# Altium schematic sheet open-weller-pen.SchDoc: Add schematic title here
size A3; CheckedBy: tbd; CompanyName: OST; Organization: OST Ostschweizer Fachhochschule; Address1: Werdenbergstrasse 4; Address2: 9471 Buchs; Address3: Switzerland; SheetNumber: 1; SheetTotal: 1; Size: A3; ShortDescription: Add schematic description here
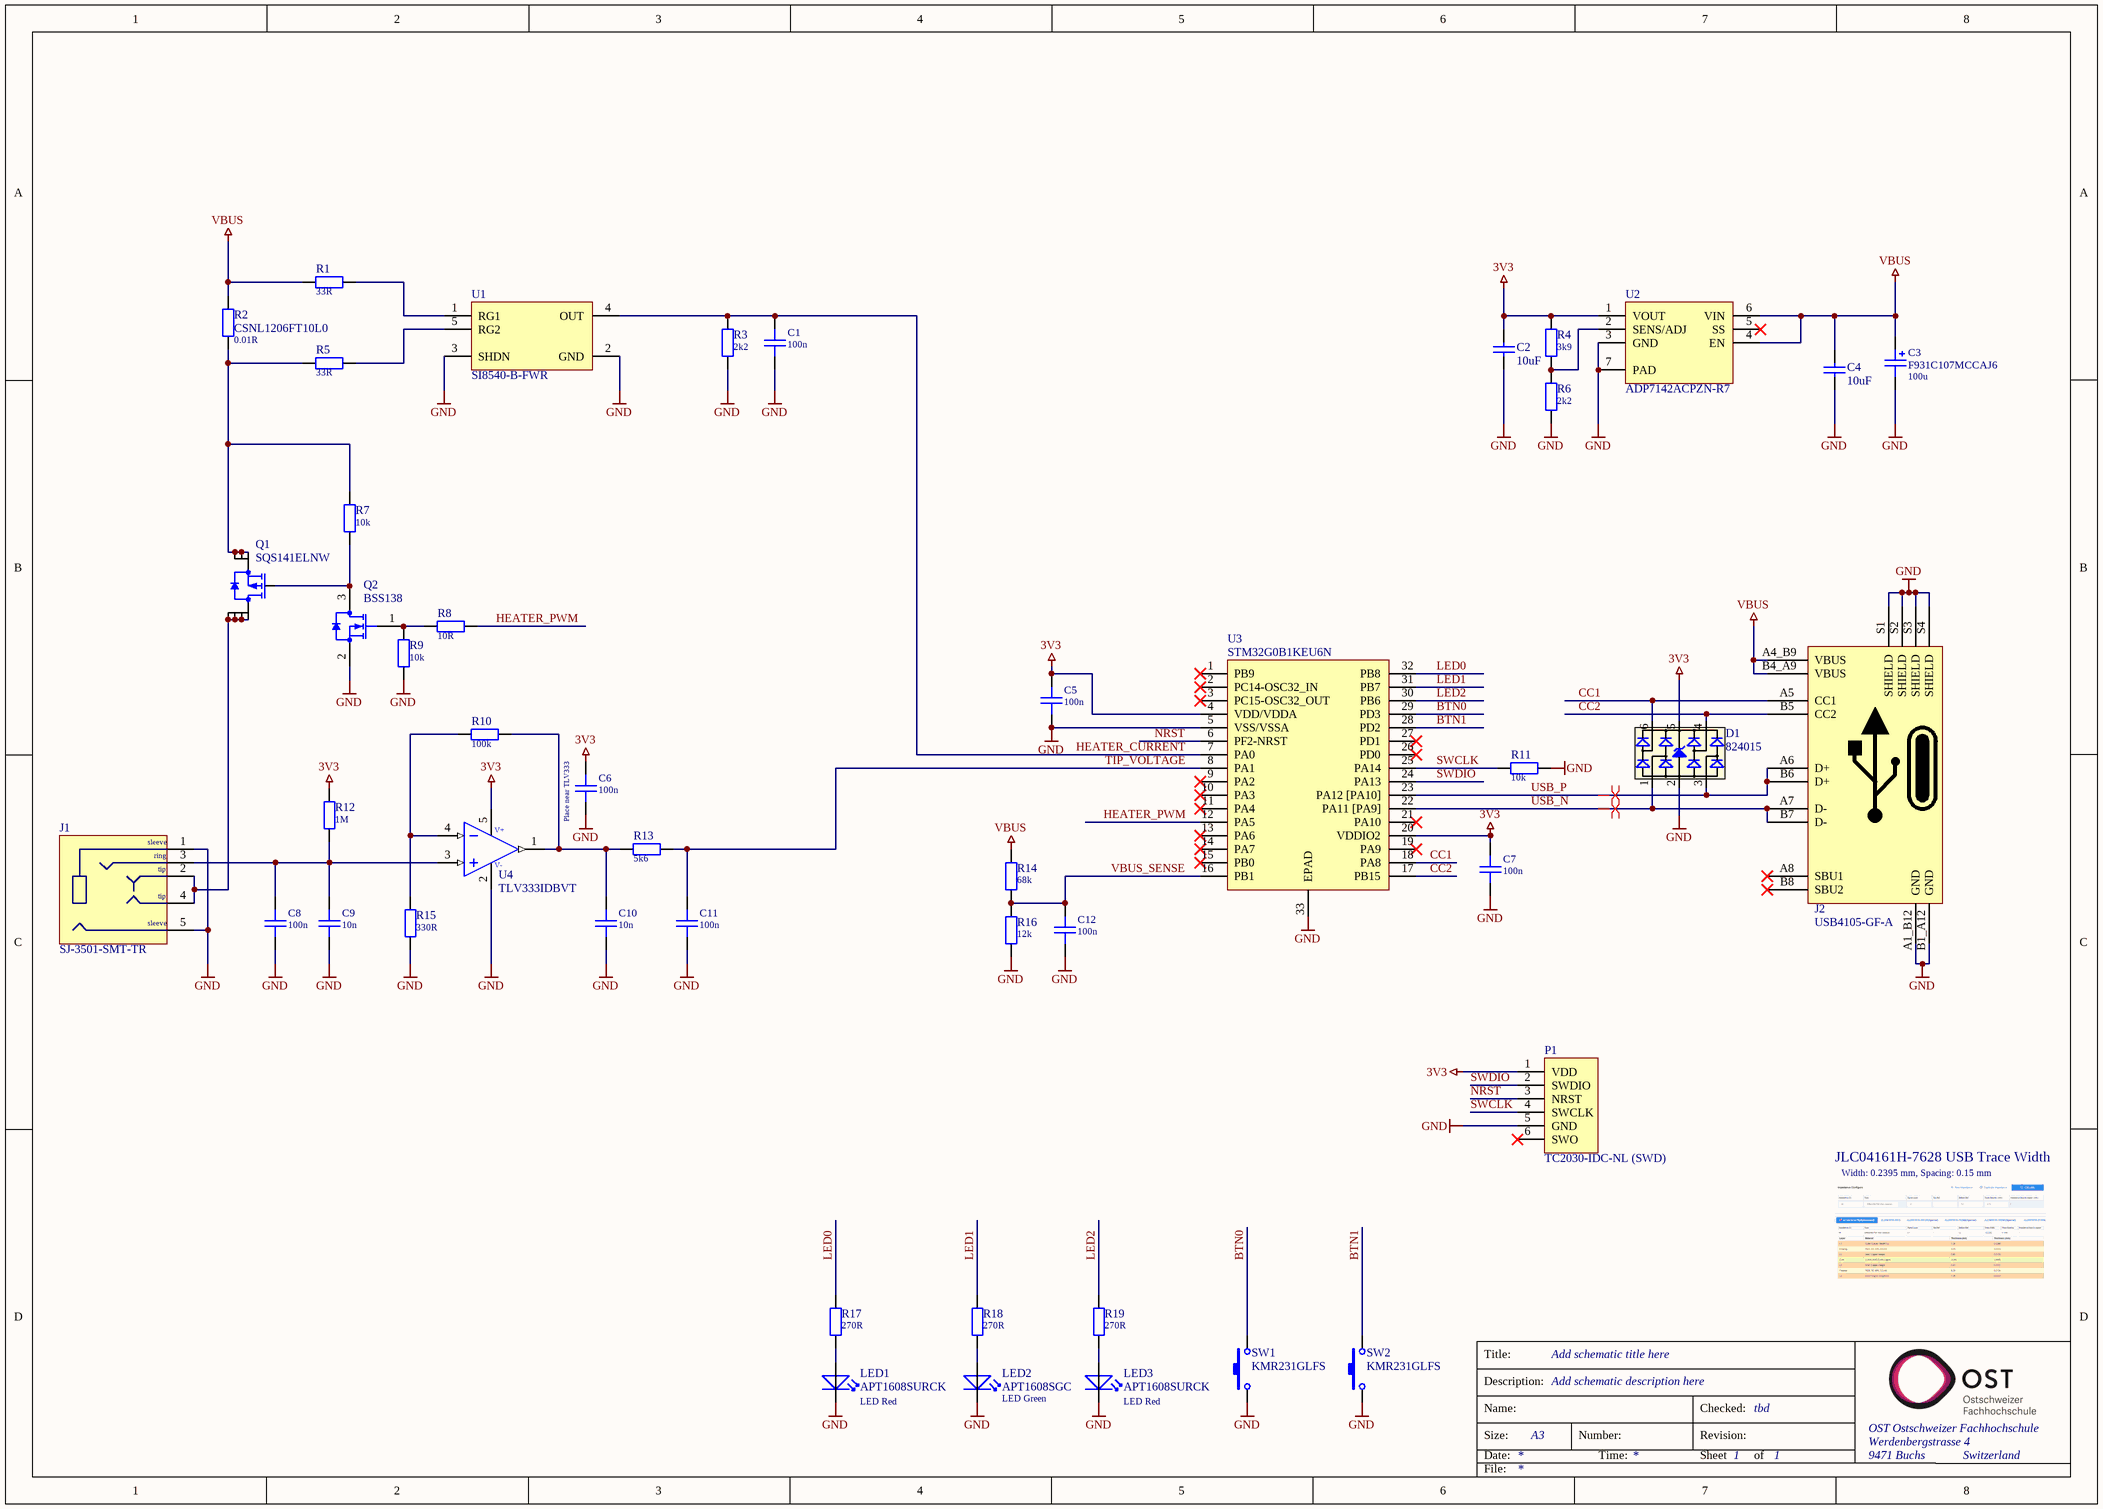
[diagram p0: open-weller-pen.SchDoc]

## Parts
C1  value 100n  [Generic_Cap0603_2_R]  (hidden comment: 06035C104kAT2A)
C2  ShortDescription: 10uF  [Generic_Cap0603_2_RW]  (hidden comment: GRM188R61E106KA73D)
C3  F931C107MCCAJ6  value 100u  [Generic_CPOL_C-2312_1P_2N_2]
C4  ShortDescription: 10uF  [Generic_Cap0603_2_RW]  (hidden comment: GRM188R61E106KA73D)
C5  value 100n  [Generic_Cap0603_2_R]  (hidden comment: 06035C104kAT2A)
C6  value 100n  [Generic_Cap0603_2_R]  (hidden comment: 06035C104kAT2A)
C7  value 100n  [Generic_Cap0603_2_R]  (hidden comment: 06035C104kAT2A)
C8  value 100n  [Generic_Cap0603_2_R]  (hidden comment: 06035C104kAT2A)
C9  value 10n  [Generic_Cap0603_2_R]  (hidden comment: 06035C103kAT2A)
C10  value 10n  [Generic_Cap0603_2_R]  (hidden comment: 06035C103kAT2A)
C11  value 100n  [Generic_Cap0603_2_R]  (hidden comment: 06035C104kAT2A)
C12  value 100n  [Generic_Cap0603_2_R]  (hidden comment: 06035C104kAT2A)
D1  824015  [GENERIC_SOT23-6_6_R]
J1  SJ-3501-SMT-TR  [CUI_SJ-3501-SMT-TR_5]
J2  USB4105-GF-A  [GCT_USB4105-GF-A_16_R]
LED1  APT1608SURCK  [Kingbright_1608_2_RW]
LED2  APT1608SGC  [Kingbright_1608_2_RW]
LED3  APT1608SURCK  [Kingbright_1608_2_RW]
P1  TC2030-IDC-NL (SWD)  [TagConnectLLC_TC2030_6]  (no BOM)
Q1  SQS141ELNW  [Vishay_PowerPAK_1212-8_8]
Q2  BSS138  [Generic_SOT23_3_RWH]
R1  value 33R  [Generic_Res0603_2_RW]  (hidden comment: RC0603FR-0733RL)
R2  CSNL1206FT10L0  value 0.01R  [Generic_Res1206_2_RW]
R3  value 2k2  [Generic_Res0603_2_RW]  (hidden comment: RC0603FR-072K2L)
R4  value 3k9  [Generic_Res0603_2_RW]  (hidden comment: RC0603FR-073K9L)
R5  value 33R  [Generic_Res0603_2_RW]  (hidden comment: RC0603FR-0733RL)
R6  value 2k2  [Generic_Res0603_2_RW]  (hidden comment: RC0603FR-072K2L)
R7  value 10k  [Generic_Res0603_2_RW]  (hidden comment: RC0603FR-0710KL)
R8  value 10R  [Generic_Res0603_2_RW]  (hidden comment: RC0603FR-0710RL)
R9  value 10k  [Generic_Res0603_2_RW]  (hidden comment: RC0603FR-0710KL)
R10  value 100k  [Generic_Res0603_2_RW]  (hidden comment: RC0603FR-07100KL)
R11  value 10k  [Generic_Res0603_2_RW]  (hidden comment: RC0603FR-0710KL)
R12  value 1M  [Generic_Res0603_2_RW]  (hidden comment: RC0603FR-071ML)
R13  value 5k6  [Generic_Res0603_2_RW]  (hidden comment: RC0603FR-075K6L)
R14  value 68k  [Generic_Res0603_2_RW]  (hidden comment: RC0603FR-0768KL)
R15  value 330R  [Generic_Res0603_2_RW]  (hidden comment: RC0603FR-07330RL)
R16  value 12k  [Generic_Res0603_2_RW]  (hidden comment: RC0603FR-0712KL)
R17  value 270R  [Generic_Res0603_2_RW]  (hidden comment: RC0603FR-07270RL)
R18  value 270R  [Generic_Res0603_2_RW]  (hidden comment: RC0603FR-07270RL)
R19  value 270R  [Generic_Res0603_2_RW]  (hidden comment: RC0603FR-07270RL)
SW1  KMR231GLFS  [CK_KMR231GLFS_4]
SW2  KMR231GLFS  [CK_KMR231GLFS_4]
U1  SI8540-B-FWR  [GENERIC_SOT23-5_5_R]
U2  ADP7142ACPZN-R7  [ANALOG_LFCSP6_7_R]
U3  STM32G0B1KEU6N  [ST_UFQFPN32_33_R]
U4  TLV333IDBVT  [TI_SOT23_5_RH]

## Nets
3V3: C2.2 C5.2 C6.2 C7.2 D1.5(VDD) P1.1(VDD) R4.1 R12.1 U2.1(VOUT) U3.4(VDD/VDDA) U3.20(VDDIO2) U4.5(V+)
GND: C1.1 C2.1 C3.2 C4.1 C5.1 C6.1 C7.1 C8.1 C9.1 C10.1 C11.1 C12.1 D1.2(GND) J1.1(sleeve) J1.5(sleeve) J2.A1_B12(GND) J2.B1_A12(GND) J2.S1(SHIELD) J2.S2(SHIELD) J2.S3(SHIELD) J2.S4(SHIELD) LED1.1(K) LED2.1(K) LED3.1(K) P1.5(GND) Q2.2(S) R3.2 R6.2 R9.2 R11.2 R15.1 R16.2 SW1.1 SW2.1 U1.2(GND) U1.3(SHDN) U2.3(GND) U2.7(PAD) U3.5(VSS/VSSA) U3.33(EPAD) U4.2(V-)
VBUS: C3.1 C4.2 J2.A4_B9(VBUS) J2.B4_A9(VBUS) R1.2 R2.1 R14.1 U2.4(EN) U2.6(VIN)
BTN0: SW1.2 U3.29(PD3)
BTN1: SW2.2 U3.28(PD2)
CC1: D1.6(I/O4) J2.A5(CC1) U3.18(PA8)
CC2: D1.4(I/O3) J2.B5(CC2) U3.17(PB15)
HEATER_CURRENT: C1.2 R3.1 U1.4(OUT) U3.7(PA0)
HEATER_PWM: R8.1 U3.12(PA5)
LED0: R17.1 U3.32(PB8)
LED1: R18.1 U3.31(PB7)
LED2: R19.1 U3.30(PB6)
NRST: P1.3(NRST) U3.6(PF2-NRST)
SWCLK: P1.4(SWCLK) R11.1 U3.25(PA14)
SWDIO: P1.2(SWDIO) U3.24(PA13)
TIP_VOLTAGE: C11.2 R13.1 U3.8(PA1)
USB_N: D1.1(I/O1) J2.A7(D-) J2.B7(D-) U3.22(PA11_[PA9])
USB_P: D1.3(I/O2) J2.A6(D+) J2.B6(D+) U3.23(PA12_[PA10])
VBUS_SENSE: C12.2 R14.2 R16.1 U3.16(PB1)
NetC8_2: C8.2 C9.2 J1.3(ring) R12.2 U4.3(IN+)
NetC10_2: C10.2 R10.2 R13.2 U4.1(OUT)
NetJ1_2: J1.2(tip) J1.4(tip) Q1.5(D) Q1.6(D) Q1.7(D) Q1.8(D)
NetLED1_2: LED1.2(A) R17.2
NetLED2_2: LED2.2(A) R18.2
NetLED3_2: LED3.2(A) R19.2
NetQ1_1: Q1.1(S) Q1.2(S) Q1.3(S) R2.2 R5.2 R7.1
NetQ1_4: Q1.4(G) Q2.3(D) R7.2
NetQ2_1: Q2.1(G) R8.2 R9.1
NetR1_1: R1.1 U1.1(RG1)
NetR4_2: R4.2 R6.1 U2.2(SENS/ADJ)
NetR5_1: R5.1 U1.5(RG2)
NetR10_1: R10.1 R15.2 U4.4(IN-)

Not connected (* = marked no-connect by the designer): J2 A8(SBU1)* B8(SBU2)*; P1 6(SWO)*; U2 5(SS)*; U3 1(PB9)* 2(PC14-OSC32_IN)* 3(PC15-OSC32_OUT)* 9(PA2)* 10(PA3)* 11(PA4)* 13(PA6)* 14(PA7)* 15(PB0)* 19(PA9)* 21(PA10)* 26(PD0)* 27(PD1)*

## Layout directives
differential pair: USB_N, USB_P

## Notes on the sheet
- (near C6) Place near TLV333
- JLC04161H-7628 USB Trace Width
- Width: 0.2395 mm, Spacing: 0.15 mm
- Title:
- Description:
- Size:
- Date:
- Name:
- Number:
- Time:
- Revision:
- Sheet
- Checked:
- of
- File:

## Library data of the parts
C1 C5-C8 C11 C12 = KYOCERA_AVX_X7R-DIELECTRIC-0000-A.1: 100n, X7R, 10%, 50V, 0603; Manufacturer: Kyocera AVX; ShortDescription: 100n; Manufacturer PartNr: 06035C104kAT2A
C2 C4 = Baugruppenfertigung-0041-A.5: 10uF, X5R, 10%, 25V; Manufacturer: Murata; Manufacturer PartNr: GRM188R61E106KA73D
C3 = KRSA-0126-A.1: 100u, TANTAL, 20%, 16V, C(2312); Manufacturer: AVX; ShortDescription: 100u; Manufacturer PartNr: F931C107MCCAJ6
C9 C10 = KYOCERA_AVX_X7R-DIELECTRIC-0001-A.2: 10n, X7R, 10%, 50V, 0603; Manufacturer: Kyocera AVX; ShortDescription: 10n; Manufacturer PartNr: 06035C103kAT2A
D1 = KRSA-0098-A.1: TVS Diode Array, 5V, Unidirectional; Manufacturer: Wurth; ShortDescription: 824015; Manufacturer PartNr: 824015
J1 = KRSA-0117-A.1: Audio Jack, 3.5mm, Mid Mount; Manufacturer: CUI; Manufacturer PartNr: SJ-3501-SMT-TR; ShortDescription: SJ-3501-SMT-TR
J2 = KRSA-0082-A.1: USB Type C, Edge Mount, USB 2.0; Manufacturer: GCT; ShortDescription: USB-C; Manufacturer PartNr: USB4105-GF-A
LED1 LED3 = Baugruppenfertigung-0039-A.1: LED Red; Manufacturer: Kingbright; Manufacturer PartNr: APT1608SURCK; ShortDescription: LED Red
LED2 = Baugruppenfertigung-0038-A.1: LED Green; Manufacturer: Kingbright; Manufacturer PartNr: APT1608SGC; ShortDescription: LED Green
P1 = 00000_Allgemein-00077-A.6: TagConnect TC2030-IDC-NL footprint for SWD debugger.; Manufacturer: TagConnectLLC; ShortDescription: 6-pin Plug-of-Nails; Manufacturer PartNr: TC2030-IDC-NL
Q1 = KRSA-0111-A.1: MOSFET, P-Ch, 40V, 100A; Manufacturer: Vishay; ShortDescription: SQS141ELNW; Manufacturer PartNr: SQS141ELNW
Q2 = 00000_Hilti_Localisation_MA-0139-A.4: MOSFET, N-Ch, 50V, 220mA; Manufacturer: ON; ShortDescription: BSS138; Manufacturer PartNr: BSS138
R1 R5 = YAEGO_RC0603FR-07-0019-A.2: 33R, 1%, 0.1W, 0603; Manufacturer: YAGEO; ShortDescription: 33R; Manufacturer PartNr: RC0603FR-0733RL
R2 = KRSA-0128-A.1: 0.01R, Shunt, 1W, 1%, 1206; Manufacturer: Stackpole Electronics Inc; ShortDescription: 0.01R; Manufacturer PartNr: CSNL1206FT10L0
R3 R6 = YAEGO_RC0603FR-07-0041-A.2: 2k2, 1%, 0.1W, 0603; Manufacturer: YAGEO; Manufacturer PartNr: RC0603FR-072K2L; ShortDescription: 2k2
R4 = YAEGO_RC0603FR-07-0044-A.1: 3k9, 1%, 0.1W, 0603; Manufacturer: YAGEO; Manufacturer PartNr: RC0603FR-073K9L; ShortDescription: 3k9
R7 R9 R11 = YAEGO_RC0603FR-07-0049-A.1: 10k, 1%, 0.1W, 0603; Manufacturer: YAGEO; ShortDescription: 10k; Manufacturer PartNr: RC0603FR-0710KL
R8 = YAEGO_RC0603FR-07-0013-A.2: 10R, 1%, 0.1W, 0603; Manufacturer: YAGEO; ShortDescription: 10R; Manufacturer PartNr: RC0603FR-0710RL
R10 = YAEGO_RC0603FR-07-0061-A.1: 100k, 1%, 0.1W, 0603; Manufacturer: YAGEO; ShortDescription: 100k; Manufacturer PartNr: RC0603FR-07100KL
R12 = YAEGO_RC0603FR-07-0073-A.1: 1M, 1%, 0.1W, 0603; Manufacturer: YAGEO; Manufacturer PartNr: RC0603FR-071ML; ShortDescription: 1M
R13 = YAEGO_RC0603FR-07-0046-A.1: 5k6, 1%, 0.1W, 0603; Manufacturer: YAGEO; Manufacturer PartNr: RC0603FR-075K6L; ShortDescription: 5k6
R14 = YAEGO_RC0603FR-07-0059-A.1: 68k, 1%, 0.1W, 0603; Manufacturer: YAGEO; ShortDescription: 68k; Manufacturer PartNr: RC0603FR-0768KL
R15 = YAEGO_RC0603FR-07-0031-A.2: 330R, 1%, 0.1W, 0603; Manufacturer: YAGEO; Manufacturer PartNr: RC0603FR-07330RL; ShortDescription: 330R
R16 = YAEGO_RC0603FR-07-0050-A.1: 12k, 1%, 0.1W, 0603; Manufacturer: YAGEO; Manufacturer PartNr: RC0603FR-0712KL; ShortDescription: 12k
R17-R19 = YAEGO_RC0603FR-07-0030-A.2: 270R, 1%, 0.1W, 0603; Manufacturer: YAGEO; Manufacturer PartNr: RC0603FR-07270RL; ShortDescription: 270R
SW1 SW2 = 10707_OST_EuR2_Projekt-0018-A.1: Tactile Switch, Thin Type; Manufacturer: CK; Manufacturer PartNr: KMR231GLFS; ShortDescription: KMR231GLFS
U1 = KRSA-0131-A.1: High-side Current Sense Amplifier; Manufacturer: Skyworks; ShortDescription: SI8540; Manufacturer PartNr: SI8540-B-FWR
U2 = KRSA-0055-A.2: 40 V, 200 mA, Low Noise, ADJ CMOS LDO Linear Regulator; Manufacturer: Analog; Manufacturer PartNr: ADP7142ACPZN-R7; ShortDescription: ADP7142
U3 = KRSA-0124-A.2: Arm Cortex-M0+ 32-bit MCU up to 512KB Flash 144KB RAM, USB-PD; Manufacturer: ST; ShortDescription: STM32G0B1KEU6N; Manufacturer PartNr: STM32G0B1KEU6N
U4 = KRSA-0108-A.1: 350kHz GBW, Low Noise, Zero Drift, 5.5V; Manufacturer: TI; ShortDescription: TLV333; Manufacturer PartNr: TLV333IDBVT